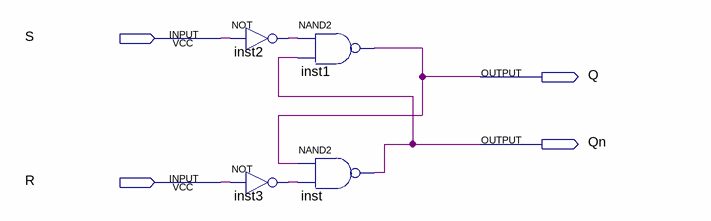
[diagram p0: schematic sheet]
// Quartus schematic lab9step1b.bdf as structural Verilog: 4 symbols, 4 pins
module lab9step1b (
  input  S,
  input  R,
  output Q,
  output Qn
);

  wire inst2_out, inst3_out;

  nand inst1 (Q, inst2_out, Qn);
  not inst2 (inst2_out, S);
  nand inst (Qn, Q, inst3_out);
  not inst3 (inst3_out, R);
endmodule
